# EAGLE schematic Horizontally_Mounted_Lighthouse (EAGLE 9.1.0)
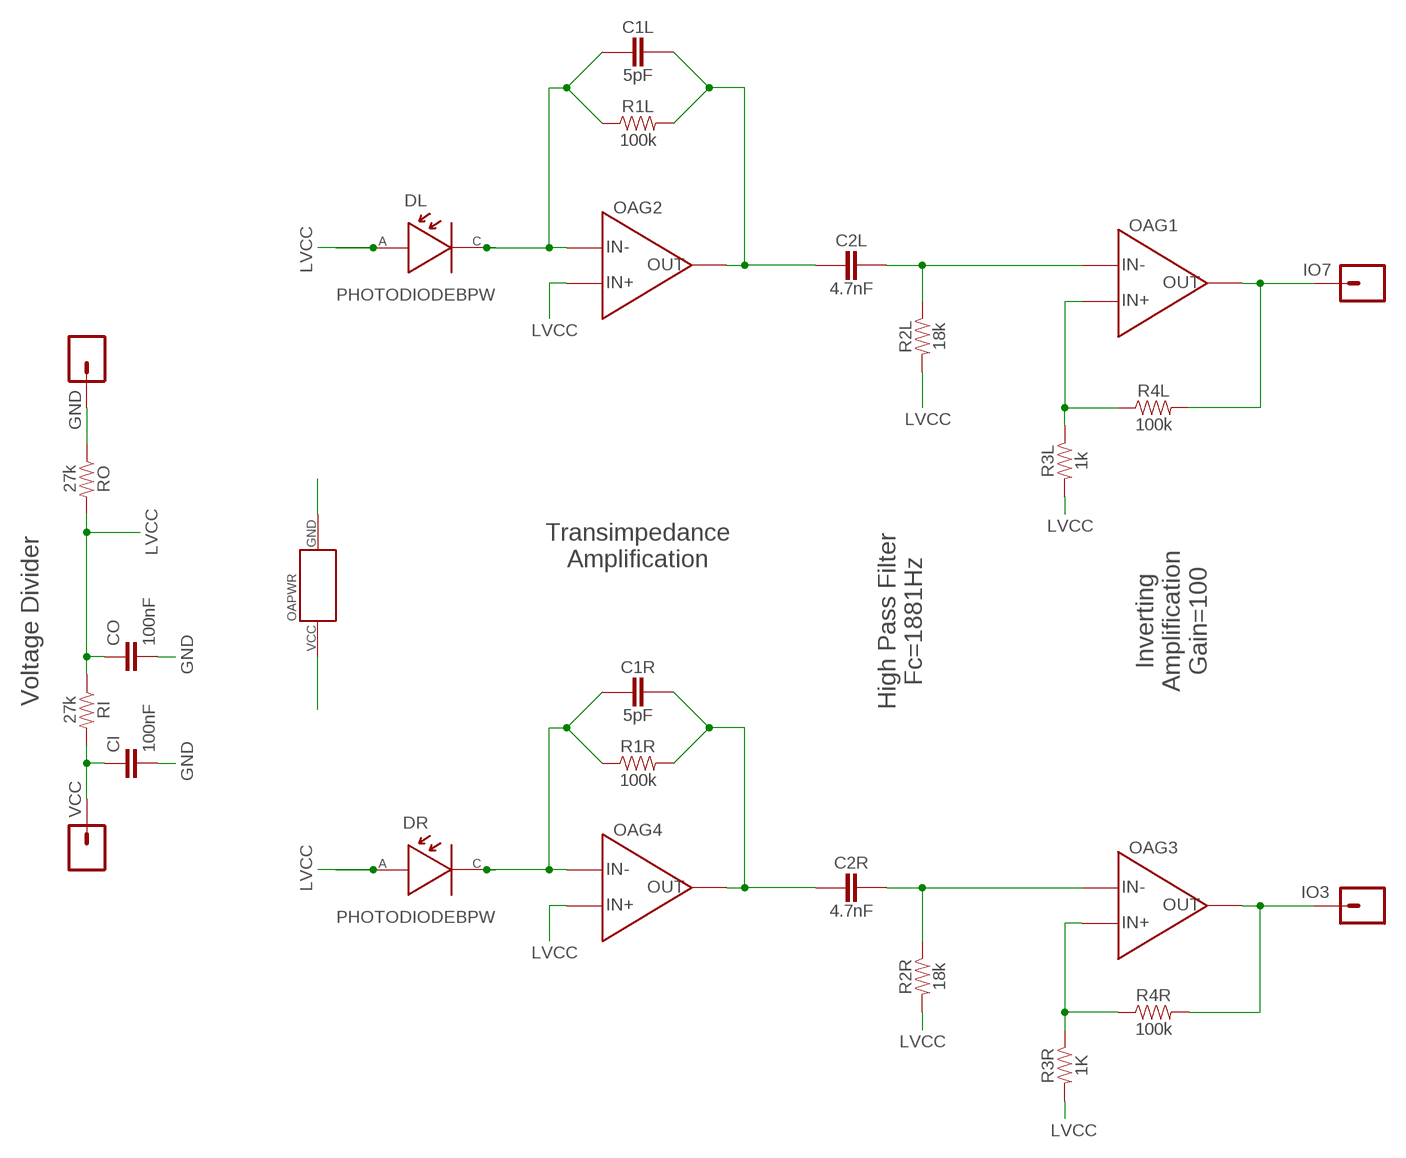
[diagram p0: schematic, sheet 1]

## Parts
C1L  5pF  CAPACITOR  [PASSIVE-0603]
C1R  5pF  CAPACITOR  [PASSIVE-0603]
C2L  4.7nF  CAPACITOR  [PASSIVE-0603]
C2R  4.7nF  CAPACITOR  [PASSIVE-0603]
CI  100nF  4.7PF-0603-50V-5%  [0603]
CO  100nF  4.7PF-0603-50V-5%  [0603]
DL  PHOTODIODEBPW  [BPW34_BP104_SMD]
DR  PHOTODIODEBPW  [BPW34_BP104_SMD]
GND  CONN_01PTH_NO_SILK_YES_STOP  [1X01_NO_SILK]
IO3  CONN_01PTH_NO_SILK_YES_STOP  [1X01_NO_SILK]
IO7  CONN_01PTH_NO_SILK_YES_STOP  [1X01_NO_SILK]
OA  TLV2464IPW  [PW14]
R1L  100k  RESISTOR  [PASSIVE-0603]
R1R  100k  RESISTOR  [PASSIVE-0603]
R2L  18k  RESISTOR  [PASSIVE-0603]
R2R  18k  RESISTOR  [PASSIVE-0603]
R3L  1k  RESISTOR  [PASSIVE-0603]
R3R  1K  RESISTOR  [PASSIVE-0603]
R4L  100k  RESISTOR  [PASSIVE-0603]
R4R  100k  RESISTOR  [PASSIVE-0603]
RI  27k  100KOHM-0603-1/10W-1%  [0603]
RO  27k  100KOHM-0603-1/10W-1%  [0603]
VCC  CONN_01PTH_NO_SILK_YES_STOP  [1X01_NO_SILK]

## Nets
DL1IN: C1L.1 DL.CATHODE OA.6(IN-) R1L.1
DL1OUT: C1L.2 C2L.1 OA.7(OUT) R1L.2
DL2F: OA.3(IN+) R3L.1 R4L.1
DL2IN: C2L.2 OA.2(IN-) R2L.1
DR1IN: C1R.1 DR.CATHODE OA.13(IN-) R1R.1
DR1OUT: C1R.2 C2R.1 OA.14(OUT) R1R.2
DR2F: OA.10(IN+) R3R.1 R4R.1
DR2IN: C2R.2 OA.9(IN-) R2R.1
GND: CI.2 CO.2 GND.1 OA.11(PWR:GND) RO.1
IO3: IO3.1 OA.8(OUT) R4R.2
IO7: IO7.1 OA.1(OUT) R4L.2
LVCC: CO.1 DL.ANODE DR.ANODE OA.5(IN+) OA.12(IN+) R2L.2 R2R.2 R3L.2 R3R.2 RI.1 RO.2
VCC: CI.1 OA.4(PWR:VCC) RI.2 VCC.1

## Notes on the sheet
- Transimpedance
  Amplification
- Voltage Divider
- High Pass Filter
  Fc=1881Hz
- Inverting
  Amplification
  Gain=100

## Library data of the parts
C1L C1R C2L C2R = ZippyComponentLibrary:CAPACITOR
CI CO = SparkFun-Capacitors:4.7PF: 4.7pF ceramic capacitors A capacitor is a passive two-terminal electrical component used to store electrical energy temporarily in an electric field.; PROD_ID: CAP-07880; VALUE: 4.7pF
DL DR = ZippyComponentLibrary:PHOTODIODE: "2x1 SMD Mounting Point For BPW34 Diode"
GND IO3 IO7 VCC = SparkFun-Connectors:CONN_01: Single connection point. Often used as Generic Header-pin footprint for 0.1 inch spaced/style header connections On any of the 0.1 inch spaced packages, you can populate with these: Break Away Headers - Straight <https://www.sparkfun.com/products/116> (PRT-00116) Break Away Male Headers - Right Angle <https://www.sparkfun.com/products/553> (PRT-00553) Female Headers <https://www.sparkfun.com/products/115> (PRT-00115) Break Away Headers - Machine Pin <https://www.sparkfun.com/products/117> (PRT-00117) Break Away Female Headers - Swiss Machine Pin <https://www.sparkfun.com/products/743> (PRT-00743) This device is also useful as a general connection point to wire up your design to another part of your project. Our various solder wires solder well into these plated through hole pads. Hook-Up Wire - Assortment (Stranded, 22 AWG) <https://www.sparkfun.com/products/11375> (PRT-11375) Hook-Up Wire - Assortment (Solid Core, 22 AWG) <https://www.sparkfun.com/products/11367> (PRT-11367) View the entire wire category on our website here <https://www.sparkfun.com/categories/141> Special notes: SMTSO-256-ET is a "flush mount" nut for a 4-40 screw. We mostly use this on specialty testbeds; it is a nice way to connect hardware to your PCB at an adjustable hieght. Also note, the SNAP packages are for using a snappable style connector. We sell a baggie of snaps and they are also used on two LilyPad designs: Snap Assortment - 30 pack (male and female) <https://www.sparkfun.com/products/11347> (DEV-11347) LilyPad Arduino SimpleSnap <https://www.sparkfun.com/products/10941> (DEV-10941) LilyPad SimpleSnap Protoboard <https://www.sparkfun.com/products/10940> (DEV-10940)
OA = ZippyComponentLibrary:TLV2464
R1L R1R R2L R2R R3L R3R R4L R4R = ZippyComponentLibrary:RESISTOR
RI RO = SparkFun-Resistors:100KOHM: 100kΩ resistor A resistor is a passive two-terminal electrical component that implements electrical resistance as a circuit element. Resistors act to reduce current flow, and, at the same time, act to lower voltage levels within circuits. - Wikipedia; PROD_ID: RES-07828; VALUE: 100k